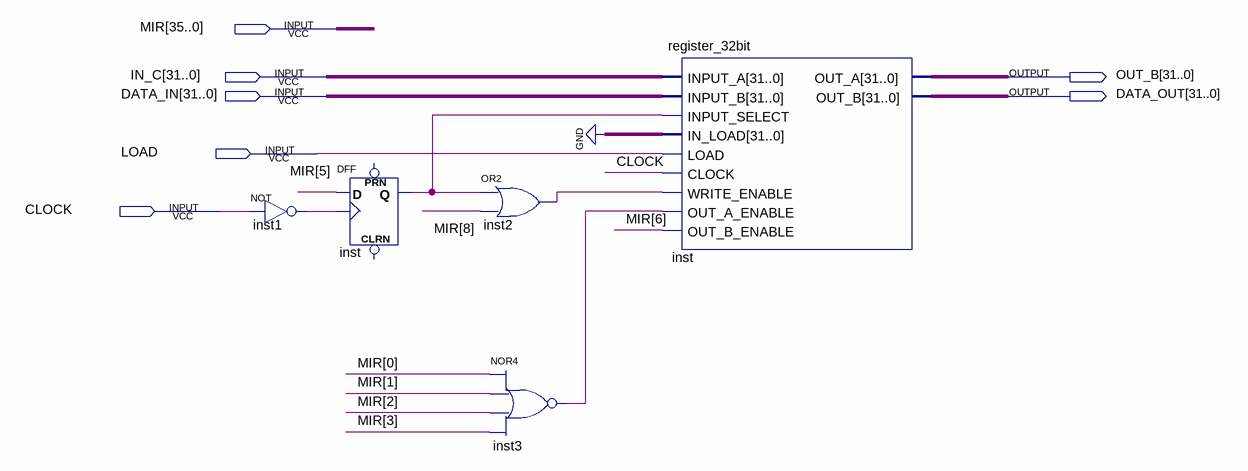
[diagram p0: schematic sheet]
// Quartus schematic MDR.bdf as structural Verilog: 5 symbols, 7 pins
module MDR (
  input  [35:0] MIR,
  input  [31:0] IN_C,
  input  [31:0] DATA_IN,
  input  LOAD,
  input  CLOCK,
  output [31:0] OUT_B,
  output [31:0] DATA_OUT
);

  wire inst1_out, inst2_out, inst3_out, inst_q;

  not inst1 (inst1_out, CLOCK);
  DFF inst (.CLK(inst1_out), .D(MIR[5]), .Q(inst_q));  // open: CLRN, PRN
  or inst2 (inst2_out, inst_q, MIR[8]);
  nor inst3 (inst3_out, MIR[0], MIR[1], MIR[2], MIR[3]);
  register_32bit inst_dup2 (
    .INPUT_A(IN_C), .INPUT_B(DATA_IN), .INPUT_SELECT(inst_q), .IN_LOAD({32{1'b0}}), .LOAD(LOAD),
    .CLOCK(CLOCK), .WRITE_ENABLE(inst2_out), .OUT_A_ENABLE(inst3_out), .OUT_B_ENABLE(MIR[6]), .OUT_A(OUT_B),
    .OUT_B(DATA_OUT));
endmodule
